# Altium project Chessboard Controller PCB.PrjPcb
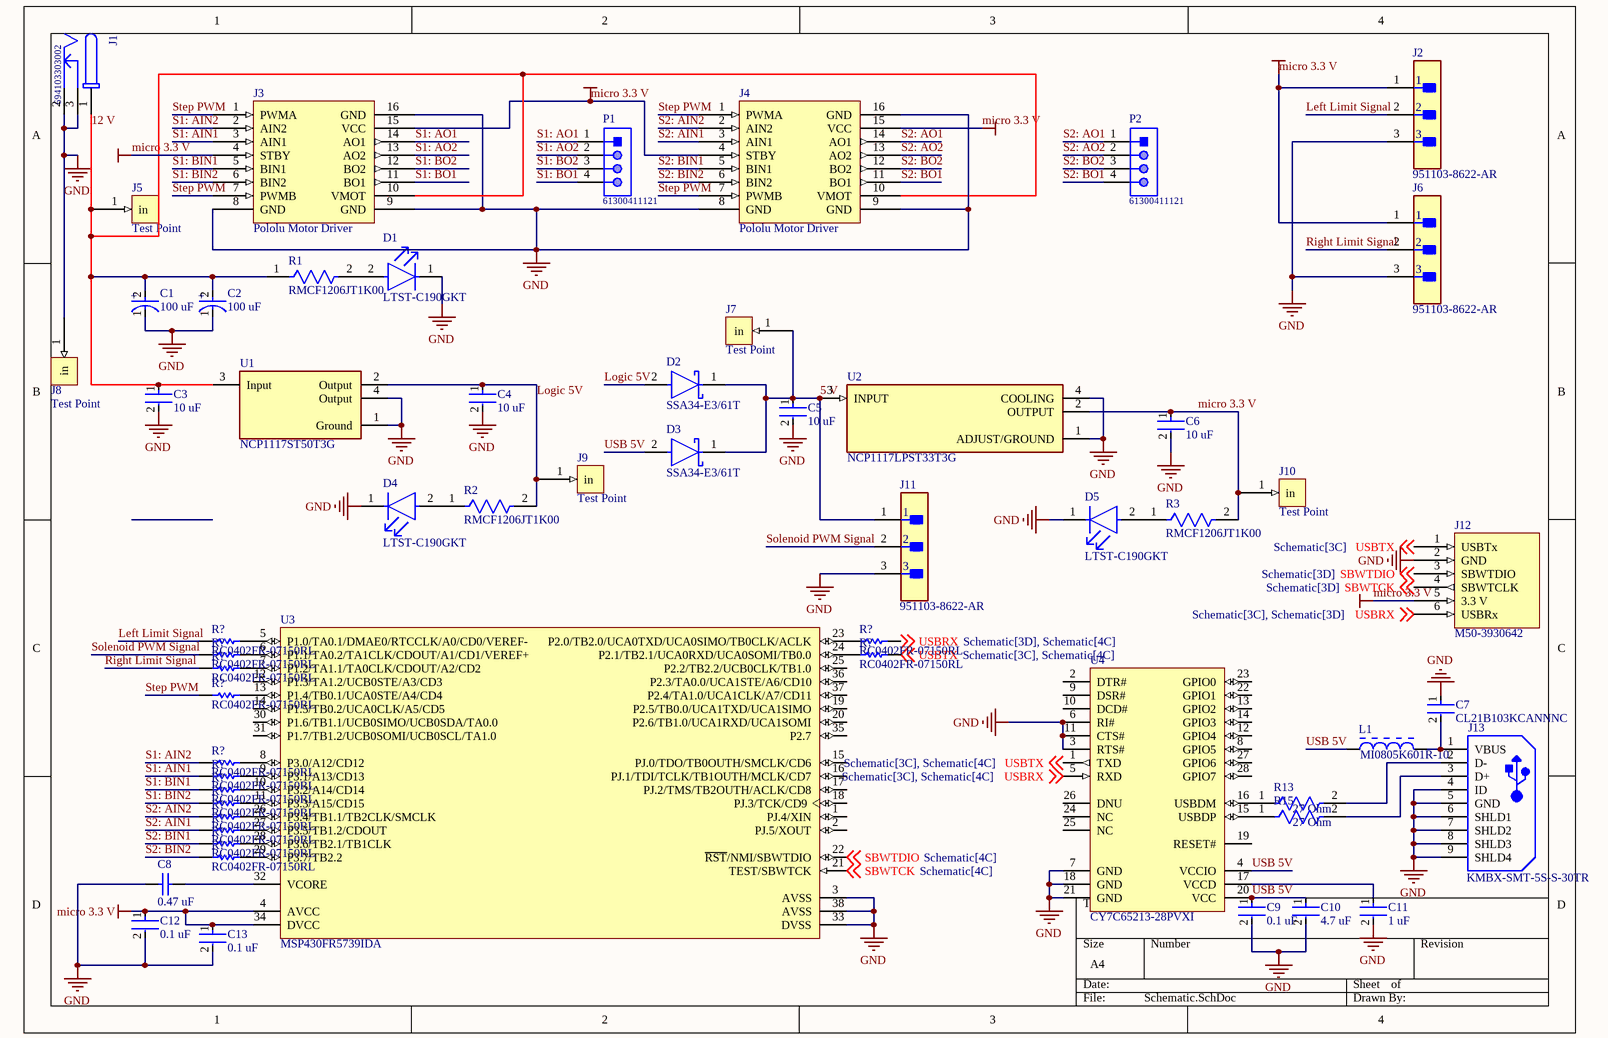
[diagram p0: Schematic.SchDoc]
1 sheet, 57 parts. Net scope: global (net labels, ports and power ports of the same name join across sheets).
Board file: PCB1.PcbDoc

## Sheet Schematic.SchDoc
size A4; SheetNumber: 1; SheetTotal: 1; SPICEModelCacheMBCRCAUM: <root> / <DocumentId>MBCRCAUM</DocumentId> / </root>

### Parts
(Parts that share a designator on the sheet are numbered #1, #2 ... from top to bottom, then left to right.)
C1  100 uF  [FP-FTC-MFG]
C2  100 uF  [FP-FTC-MFG]
C3  10 uF  [FP-CGA6P-IPC_B]
C4  10 uF  [FP-CGA6P-IPC_B]
C5  10 uF  [FP-CGA6P-IPC_B]
C6  10 uF  [FP-CGA6P-IPC_B]
C7  CL21B103KCANNNC  [FP-CL21-IPC_A]
C8  0.47 uF  [CAPC1608X90X35LL15T15]
C9  0.1 uF  [FP-1210-L_3_2_0_3-W_2_5_0-MFG]
C10  4.7 uF  [FP-CL10-IPC_C]
C11  1 uF  [FP-GRM033-0_05-e01_0_2-IPC_B]
C12  0.1 uF  [FP-1210-L_3_2_0_3-W_2_5_0-MFG]
C13  0.1 uF  [FP-1210-L_3_2_0_3-W_2_5_0-MFG]
D1  LTST-C190GKT  [FP-LTST-C190GKT-MFG]
D2  SSA34-E3/61T  [FP-95400-MFG]
D3  SSA34-E3/61T  [FP-95400-MFG]
D4  LTST-C190GKT  [FP-LTST-C190GKT-MFG]
D5  LTST-C190GKT  [FP-LTST-C190GKT-MFG]
J1  694103303002  [694103303002]
J2  951103-8622-AR  [FP-951103-8622-AR-MFG]
J3  Pololu Motor Driver  [Pololu Motor Driver-Footprint-2]
J4  Pololu Motor Driver  [Pololu Motor Driver-Footprint-2]
J5  Test Point  [Test Point-Footprint-1]
J6  951103-8622-AR  [FP-951103-8622-AR-MFG]
J7  Test Point  [Test Point-Footprint-1]
J8  Test Point  [Test Point-Footprint-1]
J9  Test Point  [Test Point-Footprint-1]
J10  Test Point  [Test Point-Footprint-1]
J11  951103-8622-AR  [FP-951103-8622-AR-MFG]
J12  M50-3930642  [M50-3930642-Footprint-1]
J13  KMBX-SMT-5S-S-30TR  [KYCN-KMBX-SMT-5S-S-30TR_V]
L1  MI0805K601R-10  [LIRD-MI0805K601R-10-2_V]
P1  61300411121  [61300411121]
P2  61300411121  [61300411121]
R1  RMCF1206JT1K00  [FP-RMCF1206-MFG]
R2  RMCF1206JT1K00  [FP-RMCF1206-MFG]
R3  RMCF1206JT1K00  [FP-RMCF1206-MFG]
R13  27 Ohm  [FP-RMCF1206-IPC_A]
R15  27 Ohm  [FP-RMCF1206-IPC_A]
R?#1  RC0402FR-07150RL  [RESC1005X40X25LL05T10]
R?#2  RC0402FR-07150RL  [RESC1005X40X25LL05T10]
R?#3  RC0402FR-07150RL  [RESC1005X40X25LL05T10]
R?#4  RC0402FR-07150RL  [RESC1005X40X25LL05T10]
R?#5  RC0402FR-07150RL  [RESC1005X40X25LL05T10]
R?#6  RC0402FR-07150RL  [RESC1005X40X25LL05T10]
R?#7  RC0402FR-07150RL  [RESC1005X40X25LL05T10]
R?#8  RC0402FR-07150RL  [RESC1005X40X25LL05T10]
R?#9  RC0402FR-07150RL  [RESC1005X40X25LL05T10]
R?#10  RC0402FR-07150RL  [RESC1005X40X25LL05T10]
R?#11  RC0402FR-07150RL  [RESC1005X40X25LL05T10]
R?#12  RC0402FR-07150RL  [RESC1005X40X25LL05T10]
R?#13  RC0402FR-07150RL  [RESC1005X40X25LL05T10]
R?#14  RC0402FR-07150RL  [RESC1005X40X25LL05T10]
U1  NCP1117ST50T3G  [FP-318H-MFG]
U2  NCP1117LPST33T3G  [FP-318H-MFG]
U3  MSP430FR5739IDA  [TI-DA38_N]
U4  CY7C65213-28PVXI  [CYP-PVX28_N]

### Nets
GND: C1.1(C) C2.1(C) C3.2 C4.2 C5.2 C6.2 C7.1 C8.1 C9.2 C10.2 C11.2 C12.2 C13.2 D1.1(C) D4.1(C) D5.1(C) J1.2 J1.3 J2.3 J3.8(GND) J3.9(GND) J3.16(GND) J4.8(GND) J4.9(GND) J4.16(GND) J6.3 J8.1(in) J11.3 J12.2(GND) J13.4(ID) J13.5(GND) J13.6(SHLD1) J13.7(SHLD2) J13.8(SHLD3) J13.9(SHLD4) U1.1(Ground) U1.4(Output) U2.1(ADJUST/GROUND) U2.4(COOLING) U3.3(AVSS) U3.33(DVSS) U3.38(AVSS) U4.3(RTS#) U4.6(RI#) U4.7(GND) U4.11(CTS#) U4.18(GND) U4.21(GND)
micro 3.3 V: C6.1 C12.1 C13.1 J2.1 J3.4(STBY) J3.15(VCC) J4.4(STBY) J4.15(VCC) J6.1 J10.1(in) J12.5(3.3_V) R3.2 U2.2(OUTPUT) U3.4(AVCC) U3.34(DVCC)
5 V: C5.1 D2.1(C) D3.1(C) J7.1(in) J11.1 U2.3(INPUT)
12 V: C1.2(A) C2.2(A) C3.1 J1.1 J3.10(VMOT) J4.10(VMOT) J5.1(in) R1.1 U1.3(Input)
Left Limit Signal: J2.2 R?#1.1
Logic 5V: C4.1 D2.2(A) J9.1(in) R2.2 U1.2(Output)
Right Limit Signal: J6.2 R?#5.1
S1: AIN1: J3.3(AIN1) R?#8.1
S1: AIN2: J3.2(AIN2) R?#7.1
S1: AO1: J3.14(AO1) P1.1
S1: AO2: J3.13(AO2) P1.2
S1: BIN1: J3.5(BIN1) R?#9.1
S1: BIN2: J3.6(BIN2) R?#10.1
S1: BO1: J3.11(BO1) P1.4
S1: BO2: J3.12(BO2) P1.3
S2: AIN1: J4.3(AIN1) R?#12.1
S2: AIN2: J4.2(AIN2) R?#11.1
S2: AO1: J4.14(AO1) P2.1
S2: AO2: J4.13(AO2) P2.2
S2: BIN1: J4.5(BIN1) R?#13.1
S2: BIN2: J4.6(BIN2) R?#14.1
S2: BO1: J4.11(BO1) P2.4
S2: BO2: J4.12(BO2) P2.3
SBWTCK: J12.4(SBWTCLK) U3.21(TEST/SBWTCK) ; off-sheet SBWTCK
SBWTDIO: J12.3(SBWTDIO) U3.22(~{RST}/NMI/SBWTDIO) ; off-sheet SBWTDIO
Solenoid PWM Signal: J11.2 R?#3.1
Step PWM: J3.1(PWMA) J3.7(PWMB) J4.1(PWMA) J4.7(PWMB) R?#6.1
USB 5V: C9.1 C10.1 D3.2(A) L1.1 U4.4(VCCIO) U4.20(VCC)
USBRX: J12.6(USBRx) R?#2.2 U4.5(RXD) ; off-sheet USBRX
USBTX: J12.1(USBTx) R?#4.2 U4.1(TXD) ; off-sheet USBTX
NetC7_2: C7.2 J13.1(VBUS) L1.2
NetC8_2: C8.2 U3.32(VCORE)
NetC11_1: C11.1 U4.17(VCCD)
NetD1_2: D1.2(A) R1.2
NetD4_2: D4.2(A) R2.1
NetD5_2: D5.2(A) R3.1
NetJ13_2: J13.2(D-) R13.2
NetJ13_3: J13.3(D+) R15.2
NetR13_1: R13.1 U4.16(USBDM)
NetR15_1: R15.1 U4.15(USBDP)
NetR?#1_2: R?#1.2 U3.5(P1.0/TA0.1/DMAE0/RTCCLK/A0/CD0/VEREF-)
NetR?#2_1: R?#2.1 U3.23(P2.0/TB2.0/UCA0TXD/UCA0SIMO/TB0CLK/ACLK)
NetR?#3_2: R?#3.2 U3.6(P1.1/TA0.2/TA1CLK/CDOUT/A1/CD1/VEREF+)
NetR?#4_1: R?#4.1 U3.24(P2.1/TB2.1/UCA0RXD/UCA0SOMI/TB0.0)
NetR?#5_2: R?#5.2 U3.7(P1.2/TA1.1/TA0CLK/CDOUT/A2/CD2)
NetR?#6_2: R?#6.2 U3.13(P1.4/TB0.1/UCA0STE/A4/CD4)
NetR?#7_2: R?#7.2 U3.8(P3.0/A12/CD12)
NetR?#8_2: R?#8.2 U3.9(P3.1/A13/CD13)
NetR?#9_2: R?#9.2 U3.10(P3.2/A14/CD14)
NetR?#10_2: R?#10.2 U3.11(P3.3/A15/CD15)
NetR?#11_2: R?#11.2 U3.26(P3.4/TB1.1/TB2CLK/SMCLK)
NetR?#12_2: R?#12.2 U3.27(P3.5/TB1.2/CDOUT)
NetR?#13_2: R?#13.2 U3.28(P3.6/TB2.1/TB1CLK)
NetR?#14_2: R?#14.2 U3.29(P3.7/TB2.2)

Not connected (* = marked no-connect by the designer): U3 1(PJ.4/XIN) 2(PJ.5/XOUT) 12(P1.3/TA1.2/UCB0STE/A3/CD3) 14(P1.5/TB0.2/UCA0CLK/A5/CD5) 15(PJ.0/TDO/TB0OUTH/SMCLK/CD6) 16(PJ.1/TDI/TCLK/TB1OUTH/MCLK/CD7) 17(PJ.2/TMS/TB2OUTH/ACLK/CD8) 18(PJ.3/TCK/CD9) 19(P2.5/TB0.0/UCA1TXD/UCA1SIMO) 20(P2.6/TB1.0/UCA1RXD/UCA1SOMI) 25(P2.2/TB2.2/UCB0CLK/TB1.0) 30(P1.6/TB1.1/UCB0SIMO/UCB0SDA/TA0.0) 31(P1.7/TB1.2/UCB0SOMI/UCB0SCL/TA1.0) 35(P2.7) 36(P2.3/TA0.0/UCA1STE/A6/CD10) 37(P2.4/TA1.0/UCA1CLK/A7/CD11); U4 2(DTR#) 8(GPIO5) 9(DSR#) 10(DCD#) 12(GPIO4) 13(GPIO2) 14(GPIO3) 19(RESET#) 22(GPIO1) 23(GPIO0) 24(NC) 25(NC) 26(DNU) 27(GPIO6) 28(GPIO7)

### Notes on the sheet
- (in symbol CMP-05427-000077-1) +

### Library data of the parts
C1 C2 = CMP-05427-000077-1: CAP ALUM 100UF 20% 16V SMD; Life (Hours): 2000Hour; Ripple Current: 240mA; Leakage Current: 16uA; Lead Diameter: 0.65mm; ESR (Equivalent Series Resistance): 360mR; Capacitance: 100uF; Voltage Rating: 16V; Lead Pitch: 1.5mm; RoHS Compliant: Yes; Mount: Surface Mount; Tolerance: 20%; Contact Plating: Tin; Length: 5.8mm; Voltage: 16V; REACH SVHC: No SVHC; Max Operating Temperature: 105°C; Series: FT; Min Operating Temperature: -55°C; Diameter: 5mm; Case/Package: Radial; Radiation Hardening: No; Height - Seated (Max): 0.24inch; Construction: Cylindrical; Packaging: Tape and Reel; Voltage Rating (DC): 16V; Termination: SMD/SMT; Package Quantity: 1000; Ripple Current (AC): 240mA; Height: 5.8mm
C3-C6 = CMP-08246-001838-1: Cap Ceramic 10uF 25V X7R 20% Pad SMD 1210 +125°C Automotive T/R; Tolerance: 20%; Case/Package: 1210; Thickness: 0.11inch; Case Code (Metric): 3225; Packaging: Tape and Reel; Depth: 2.5mm; Termination: SMD/SMT; Dielectric: X7R; Width: 0.098inch; Weight: 0.000564oz; Mount: Surface Mount; Min Operating Temperature: -55°C; Height: 2.5mm; Package Quantity: 1; Ratings: AEC-Q200; Max Operating Temperature: 125°C; Capacitance: 10uF; Case Code (Imperial): 1210; Voltage Rating: 25V; Composition: Ceramic; Length: 3.2mm; Voltage Rating (DC): 25V
C7 = CMP-13271-003077-1: CL21 Series 0805 10nF 100V ±10% Tolerance X7R Multilayer Ceramic Chip Capacitor; Voltage: 100V; Contact Plating: Tin; Height: 0.65mm; Thickness: 0.03inch; Min Operating Temperature: -55°C; Capacitance: 10nF; Length: 2mm; Max Operating Temperature: 125°C; Case Code (Imperial): 0805; Radiation Hardening: No; Dielectric: X7R; Material: Ceramic; Depth: 1.25mm; Voltage Rating: 100V; Case/Package: 0805; Tolerance: 10%; Package Quantity: 1; Width: 0.049inch; Mount: Surface Mount; Case Code (Metric): 2012; Packaging: Tape and Reel
C8 = CMP-2006-04570-1: Part Number: 0603ZG474ZAT2A; Manufacturer: AVX Interconnect / Elco
C9 C12 C13 = CMP-14477-003861-2: None; Tolerance: 20%; Voltage Rating: 100V; Dielectric Material: Ceramic; Dielectric: X7R; Capacitance: 100nF; RoHS Compliant: Yes; Height: 1.15mm; Halogen Free: Halogen Free; Case Code (Imperial): 1210; Depth: 2.5mm; Number of Pins: 2; Case/Package: 1210; Termination: SMD/SMT; Packaging: Tape and Reel; Radiation Hardening: No; Min Operating Temperature: -55°C; Construction: Flat; Series: M; Thickness: 0.049inch; Max Operating Temperature: 125°C; Voltage Rating (DC): 100V; Length: 0.126inch; Width: 0.098inch; Package Quantity: 2000; Resistor Type: Ceramic; Case Code (Metric): 3225; Mount: Surface Mount
C10 = CMP-13271-003017-1: Cap Ceramic 4.7uF 10V X5R ±10% Pad SMD 0603 +85°C T/R; Capacitance: 4.7uF; Case/Package: 0603; Packaging: Tape and Reel; Width: 0.031inch; Contact Plating: Tin; Thickness: 0.035inch; Package Quantity: 1; Voltage Rating: 10V; Case Code (Metric): 1608; Case Code (Imperial): 0603; Depth: 0.8mm; Height: 0.8mm; Tolerance: 10%; Max Operating Temperature: 85°C; Length: 1.6mm; Dielectric: X5R; Mount: Surface Mount; Radiation Hardening: No; Min Operating Temperature: -55°C
C11 = CMP-06035-049033-1: Chip Multilayer Ceramic Capacitors for General Purpose, 0201, 1.0uF, X5R, 15%, 20%, 6.3V; Capacitance: 1uF; Max Operating Temperature: 85°C; Depth: 0.3mm; Case Code (Imperial): 0201; Voltage Rating (DC): 6.3V; Height: 0.3mm; Mount: Surface Mount; Weight: 1.2E-05oz; Packaging: Cut Tape; Dielectric: X5R; Width: 0.3mm; REACH SVHC: No SVHC; Package Quantity: 1; Case Code (Metric): 0603; Min Operating Temperature: -55°C; Case/Package: 0201; Tolerance: 20%; Thickness: 300um; Lead Free: Lead Free; Length: 0.6mm; Termination: SMD/SMT; Voltage: 6.3V; Voltage Rating: 6.3V
D1 D4 D5 = CMP-22017-000005-2: LED GREEN CLEAR CHIP SMD; Dominant Wavelength: 569nm; Reverse Voltage: 5V; Lens Color: Colorless; Viewing Angle: 130°; Voltage: 2V; Forward Current: 30mA; Power Dissipation: 100mW; Luminous Intensity: 6mcd; Number of LEDs: 1; Forward Voltage: 2.1V; Wavelength: 565nm; Test Current: 10mA; Min Operating Temperature: -55°C; Lens Style: Clear; Mount: Surface Mount; Width: 0.8mm; Packaging: Tape and Reel; Lens Transparency: Clear; Case Code (Metric): 1608; Depth: 0.8mm; Case Code (Imperial): 0603; Case/Package: 0603; Number of Pins: 2; Max Operating Temperature: 85°C; Lead Free: Lead Free; Number of Elements: 1; Length: 1.6mm; Height: 0.8mm; Package Quantity: 1; Power Rating: 100mW; Radiation Hardening: No; Illumination Color: Green; Color: Green
D2 D3 = CMP-02539-000022-2: DIODE SCHOTTKY 40V 3A DO214AC; Element Configuration: Single; Max Reverse Leakage Current: 200uA; Polarity: Standard; Peak Non-Repetitive Surge Current: 75A; Forward Voltage: 490mV; Radiation Hardening: No; Current Rating: 3A; Contact Plating: Tin; Output Current: 3A; Height: 2.087mm; Mount: Surface Mount; Case/Package: SMA; Packaging: Tape and Reel; Width: 2.79mm; Average Rectified Current: 3A; Max Repetitive Reverse Voltage (Vrrm): 40V; Max Operating Temperature: 150°C; Length: 4.5mm; RoHS Compliant: Yes; Max Reverse Current: 200uA; Voltage Rating (DC): 40V; Min Operating Temperature: -65°C; Max Reverse Voltage (DC): 40V; Number of Pins: 2; Max Forward Surge Current (Ifsm): 75A; Lead Free: Lead Free; Forward Current: 3A; Max Surge Current: 75A; Package Quantity: 1
J1 = CMP-002-00072-1: DC Power Jack Connector WR-DC, Male, Right Angled, THT, 2 A, 30 V
J2 J6 J11 = CMP-05379-000003-1: CONN HEADER VERT 3POS 2MM; Manufacturer: 3M; Conn Gender: Male; Current Rating: 2A; Number Of Contacts: 3; Conn Orientation: Straight; Digikey Description: CONN HEADER VERT 3POS 2MM; Device Class L3: unset; Category: Conn; Height: 6.3mm; Manufacturer Part Number: 951103-8622-AR; RoHS: TRUE; Contact Material: Gold,Nickel; ComponentLink2Description: Datasheet; Temperature Range Low: -55°C; Device Class L1: Connectors; Pitch: 2mm; Mouser Description: Header; PinStrip; CopperAlloy; HighTempThermoplastic; 3Cnts; 1A; RtAngle; 951Series; Octopart: https://octopart.com/951103-8622-ar-3m-14400669; Package: 951103-8622-AR; Lead Free: Yes; Device Class L2: Headers and Wire Housings; Temperature Range High: +125°C; ComponentLink2URL: http://multimedia.3m.com/mws/media/1400506O/3m-pin-strip-header-951-series-78-5100-2653-3.pdf; Automotive: No; Temperature: -55°C to +125°C; Number Of Rows: 1
J3 J4 = CMP-00028-00007-3: Set up for the Pololu Motor Driver
J5 J7-J10 = CMP-00000-3: Test point to check infromation about pcb
J12 = CMP-002-00071-5: Btb Conn, Header, 6Pos, 1Rows, 1.27Mm; Rohs Compliant: Yes; Current Rating: 1A; Number of Positions: 6; Packaging: Bulk; Min Operating Temperature: -40°C; Contact Finish - Mating: GOLD; Contact Shape: Square; Contact Material: Brass; Termination: Solder; Series: Archer M50; Contact Type: Male Pin; Contact Plating: Gold; Insulation Color: Black; Mount: Through Hole; Connector Type: Header; Fastening Type: Pull; Flammability Rating: UL94 V-0; Number of Rows: 1; Insulation Material: Nylon; Max Operating Temperature: 105°C
J13 = CMP-1673-00002-6: Female Mini-USB, RA, -55 to 85 degC, 5-Pin SMD, RoHS, Tape and Reel; Manufacturer: Kycon; Current Rating: 1 A; Connector Type: USB; Contact Material: Bronze; Packaging: Tape and Reel; ComponentLink1Description: Manufacturer URL; Mount: Surface Mount; ComponentLink2URL: https://datasheet.ciiva.com/4599/kmbx-smt-5s-s-30tr-180268-4599029.pdf; Colour: Black; Length: 9.9 mm; RoHSCompliant: true; Pins: 5; Mounting Technology: Surface Mount; Height: 3.9 mm; PackageDescription: 5-Pin Surface Mount Device, Body 9.9 x 9.2 mm, Pitch 0.8 mm; ComponentLink1URL: http://www.kycon.com/; PackageReference: KMBX-SMT-5S-S-30TR; ComponentLink2Description: Datasheet; DatasheetVersion: Rev. A7, 11/2013; Contact Plating: Gold; Lead Pitch: 0.8 mm
L1 = CMP-2000-05196-1: Chip Bead for Power Filtering, 1500 mA, 600 Ohm, -40 to 125 degC, 0805 (2012 Metric), RoHS, Tape and Reel; Manufacturer: Laird; Filter Type: PowerLine; Current Rating (Max): 1.5A; Catalog Drawings: (HI,HZ,LI,MI)0805Series_1.10mmMax.Height; Impedance @ Frequency: 600Ohm@100MHz; Number of Lines: 1; DC Resistance (DCR) (Max): 100mOhm; Other Names: 240-2390-1; Kits: 240-2227-ND-KITEMIFERRITEBEADCHIPSMD; Online Catalog: MISeries; Standard Package: 1; Datasheet Version: Rev. A, 01/2004; Height (Max): 0.043"(1.10mm); Category: Filters; Operating Temperature: -40degC~125degC; Package Description: 2-Pin Surface Mount Device, Body 2 x 1.25 mm; Package / Case: 0805(2012Metric); Package Reference: MI0805K601R-10-2; Packaging: CutTape(CT); Ratings: -; Mounting Type: SurfaceMount; Datasheet URL: https://datasheet.ciiva.com/3082/mi0805k601r-10-a-vp-3082219.pdf; Size / Dimension: 0.079"Lx0.049"W(2.00mmx1.25mm); Family: FerriteBeadsandChips; Manufacturer URL: https://www.lairdtech.com; Series: MI
P1 P2 = CMP-1502-01064-1: THT Vertical Pin Header WR-PHD, Pitch 2.54 mm, Single Row, 4 pins; Manufacturer: Wurth Elektronik; Withstanding Voltage: 500VAC; Rated Current: 3A; Working Voltage: 250VAC; Pin Number: 4; Gender: Male; Contact Resistance: 20mOhm; Pitch: 2.54mm; Manufacturer URL: http://www.we-online.de; Operating Temperature: -40to105degC; Packaging: Bag; Mounting Technology: THT; Package Reference: 61300411121; Datasheet URL: https://katalog.we-online.de/em/datasheet/6130xx11121.pdf; Publisher: WurthElektronik; Part Number: 61300411121; Row Number: Single; Orientation: Vertical
R1-R3 = CMP-26527-000044-1: 1kΩ ±5% 0.25W 1206 Thick Film Chip Resistor AEC-Q200 compliant; Temperature Coefficient: 200ppm/°C; Power Rating: 250mW; Working Voltage: 200V; Resistance: 1kR; Min Operating Temperature: -55°C; Mount: Surface Mount; Number of Terminations: 2; Case Code (Imperial): 1206; Case Code (Metric): 3216; Packaging: Tape and Reel; Tolerance: 5%; Height: 0.028inch; Length: 3.2mm; Features: Automotive AEC-Q200; Depth: 1.6mm; RoHS Compliant: Yes; Resistor Type: Thick Film; Width: 0.063inch; Lead Free: Lead Free; Max Power Dissipation: 250mW; Construction: Rectangular; Case/Package: 1206; Max Operating Temperature: 155°C; Contact Plating: Tin; Radiation Hardening: No; Series: RMCF; Military Standard: Not
R13 R15 = CMP-26527-000116-1: 27Ω ±5% 0.25W 1206 Thick Film Chip Resistor AEC-Q200 compliant; Temperature Coefficient: 200ppm/°C; Resistance: 27R; Max Power Dissipation: 250mW; Resistor Type: Thick Film; Features: Automotive AEC-Q200; Length: 0.126inch; Radiation Hardening: No; Case Code (Metric): 3216; Series: RMCF; Width: 0.063inch; Max Operating Temperature: 155°C; Number of Terminations: 2; Case/Package: 1206; Min Operating Temperature: -55°C; Tolerance: 5%; Contact Plating: Tin; Height: 0.028inch; RoHS Compliant: Yes; Case Code (Imperial): 1206; Mount: Surface Mount; Packaging: Tape and Reel
R?#1-R?#14 = CMP-2002-07401-1: Manufacturer: Yageo / Phycomp; Part Number: RC0402FR-07150RL
U1 = CMP-0592-00001-4: IC REG LINEAR 5V 1A SOT223; Output Voltage Accuracy: 1%; Number of Outputs: 1; Dropout Voltage: 1.2V; Polarity: Positive; Power Rating: 781mW; Input Bias Current: 6mA; Quiescent Current: 10mA; Output Type: Fixed; Max Input Voltage: 20V; Min Input Voltage: 3.5V; Max Operating Temperature: 125°C; Number of Pins: 4; Case/Package: SOT-223; Min Operating Temperature: 0°C; Accuracy: 1%; Contact Plating: Tin; Min Current Limit: 1A; Output Current: 1A; Max Output Current: 1A; Length: 6.7mm; Packaging: Tape and Reel; Package Quantity: 1; Height: 1.69mm; REACH SVHC: No SVHC; Width: 3.7mm; Halogen Free: Halogen Free; RoHS Compliant: Yes; Nominal Output Voltage: 5V; Lead Free: Lead Free; Radiation Hardening: No; Tolerance: 1%; Number of Regulators: 1; Output Voltage: 5V
U2 = CMP-07128-000031-1: IC REG LINEAR 3.3V 1A SOT223; Output Type: Fixed; Dropout Voltage: 1.3V; Min Input Voltage: -300mV; Power Supply Rejection Ratio (PSRR): 60dB; Number of Outputs: 1; Reference Voltage: 1.275V; Quiescent Current: 700uA; Max Input Voltage: 18V; Polarity: Positive; Min Current Limit: 1.1A; Height: 1.69mm; Mount: Surface Mount; Min Output Voltage: 3.3V; Case/Package: SOT-223; Length: 6.7mm; Nominal Output Voltage: 3.3V; Output Current: 1A; Number of Regulators: 1; Max Operating Temperature: 125°C; Packaging: Tape and Reel; Number of Pins: 3; Min Operating Temperature: 0°C; Halogen Free: Halogen Free; Contact Plating: Tin; Width: 3.7mm; REACH SVHC: No SVHC; Package Quantity: 1; Output Voltage: 3.3V; Lead Free: Lead Free; Max Output Current: 1A
U3 = CMP-0365-00023-1: 24 MHz Mixed Signal Microcontroller, 1024 B SRAM and 33 GPIOs, -40 to 85 degC, 38-pin SOP (DA), Green (RoHS & no Sb/Br); Manufacturer: Texas Instruments; Multiplier: 32x32; USCI_B (I2C & SPI): 1; Timers - 16-bit: 5; ADC: 10-bit SAR; FRAM(KB): 16; DMA: 3; Brown Out Reset: Yes; SRAM(B): 1024; Frequency(MHz): 24; ADC Channels: 14; GPIO: 33; SubFamily: FRAM Series; USCI_A (UART/LIN/IrDA/SPI): 2; Eco-Plan: Green (RoHS & no Sb/Br); ComponentLink2URL: http://www.ti.com/general/docs/lit/getliterature.tsp?genericPartNumber=MSP430FR5739&fileType=pdf; ComponentLink1URL: http://www.ti.com/; ComponentLink1Description: Manufacturer URL; ComponentLink3URL: http://www.ti.com/lit/ml/mtss002e/mtss002e.pdf; PartNumber: MSP430FR5739IDA; ComponentLink2Description: Datasheet; Mounting Technology: Surface Mount; PackageReference: DA38; DatasheetVersion: SLAS639D; Comparators: Yes; PackageVersion: 4040066/F; Code_JEDEC: MO-153; PackageDescription: 38-Pin Plastic Small-Outline Package, Body 6.10 x 12.50 mm, Pitch 0.65 mm; ComponentLink3Description: Package Specification; SVS: Yes; Real-Time Clock: Yes; Watchdog: Yes
U4 = CMP-0967-00144-1: USB-UART LP Bridge Controller, 0.5 KB, 8 I/Os, 1.71 to 5.5 V, -40 to 85 degC, 28-Pin SSOP (PVX28), Tray; Manufacturer: Cypress; CPU Core: M8; Memory Size (KB): 0.5; Max. Operating Voltage (V): 5.5; No. of I/Os: 8; Memory Architecture: Flash; Min. Operating Voltage (V): 1.71; PackageDescription: 28-Pin Super Small Outline Package, Body 10.2 x 5.3 mm, Pitch 0.65 mm; PackageVersion: Rev. *C, 10/2001; ComponentLink2Description: Datasheet; Max. Operating Temp. (degreesC): 85; RoHS: Pb-Free; Packing: Tray; Mounting Technology: Surface Mount; PartNumber: CY7C65213-28PVXI; ComponentLink3URL: http://www.cypress.com/?docID=1371; ComponentLink3Description: Package Specification; Min. Operating Temp. (degreesC): -40; ComponentLink2URL: http://www.cypress.com/?docID=47660; PackageReference: PVX28; ComponentLink1URL: http://www.cypress.com/; DatasheetVersion: Rev. *G; ComponentLink1Description: Manufacturer URL